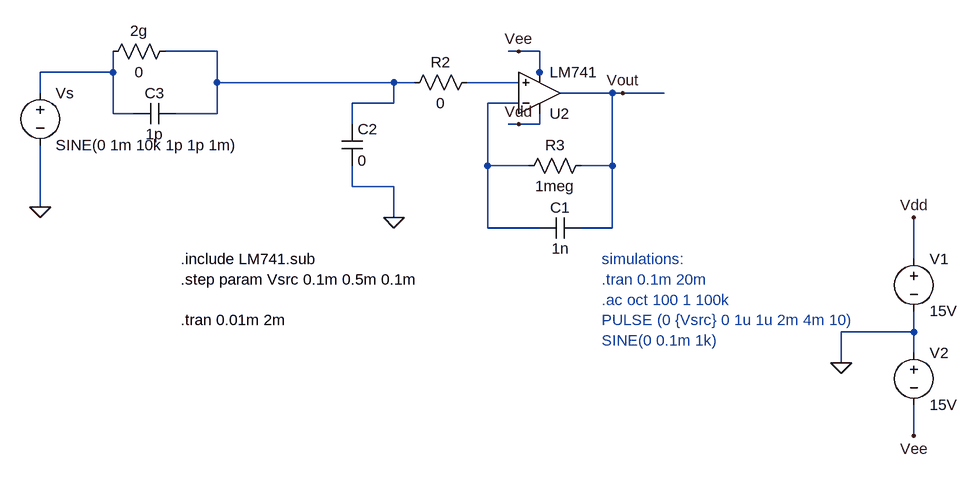
[diagram p0: schematic PiezoSensor.asc]
PiezoSensor.asc, the LTspice schematic file:
Version 4
SHEET 1 1256 680
WIRE 112 -80 32 -80
WIRE 576 -80 560 -80
WIRE 608 -80 576 -80
WIRE -48 -48 -48 -80
WIRE -48 -48 -160 -48
WIRE 608 -48 608 -80
WIRE 112 -32 112 -80
WIRE 384 -32 112 -32
WIRE 416 -32 384 -32
WIRE 576 -32 496 -32
WIRE 608 -32 608 -48
WIRE -160 -16 -160 -48
WIRE 720 -16 640 -16
WIRE 736 -16 720 -16
WIRE 800 -16 736 -16
WIRE 384 0 384 -32
WIRE 384 0 320 0
WIRE 576 0 528 0
WIRE -48 16 -48 -48
WIRE -16 16 -48 16
WIRE 112 16 112 -32
WIRE 112 16 48 16
WIRE 320 32 320 0
WIRE 576 32 560 32
WIRE 608 32 608 16
WIRE 608 32 576 32
WIRE 528 96 528 0
WIRE 592 96 528 96
WIRE 720 96 720 -16
WIRE 720 96 672 96
WIRE 320 128 320 96
WIRE 384 128 320 128
WIRE -160 160 -160 64
WIRE 384 176 384 128
WIRE 528 192 528 96
WIRE 608 192 528 192
WIRE 720 192 720 96
WIRE 720 192 672 192
WIRE 1184 240 1184 176
WIRE 1184 352 1184 320
WIRE 1184 352 1072 352
WIRE 1184 384 1184 352
WIRE 1072 400 1072 352
WIRE 1184 512 1184 464
FLAG 1072 400 0
FLAG 1184 176 Vdd
FLAG 1184 512 Vee
FLAG -160 160 0
FLAG 384 176 0
FLAG 576 -80 Vee
FLAG 736 -16 Vout
FLAG 576 32 Vdd
SYMBOL voltage 1184 224 R0
SYMATTR InstName V1
SYMATTR Value 15V
SYMBOL voltage 1184 368 R0
SYMATTR InstName V2
SYMATTR Value 15V
SYMBOL voltage -160 -32 R0
SYMATTR InstName Vs
SYMATTR Value SINE(0 1m 10k 1p 1p 1m)
SYMATTR Value2 AC 1m
SYMBOL res 48 -96 R90
WINDOW 0 0 56 VBottom 2
WINDOW 3 32 56 VTop 2
SYMATTR InstName 2g
SYMATTR Value 0
SYMBOL cap 304 32 R0
SYMATTR InstName C2
SYMATTR Value 0
SYMBOL res 512 -48 R90
WINDOW 0 0 56 VBottom 2
WINDOW 3 32 56 VTop 2
SYMATTR InstName R2
SYMATTR Value 0
SYMBOL res 688 80 R90
WINDOW 0 0 56 VBottom 2
WINDOW 3 32 56 VTop 2
SYMATTR InstName R3
SYMATTR Value 1meg
SYMBOL cap 672 176 R90
WINDOW 0 0 32 VBottom 2
WINDOW 3 32 32 VTop 2
SYMATTR InstName C1
SYMATTR Value 1n
SYMBOL Opamps/opamp2 608 48 M180
SYMATTR InstName U2
SYMATTR Value LM741
SYMBOL cap 48 0 R90
WINDOW 0 0 32 VBottom 2
WINDOW 3 32 32 VTop 2
SYMATTR InstName C3
SYMATTR Value 1p
TEXT 56 240 Left 2 !.include LM741.sub\n.step param Vsrc 0.1m 0.5m 0.1m\n\n.tran 0.01m 2m
TEXT 704 240 Left 2 ;simulations:\n.tran 0.1m 20m\n.ac oct 100 1 100k\nPULSE (0 {Vsrc} 0 1u 1u 2m 4m 10)\nSINE(0 0.1m 1k)

The netlist it stands for:
* PiezoSensor.asc
V1 Vdd 0 15V
V2 0 Vee 15V
Vs N002 0 SINE(0 1m 10k 1p 1p 1m) AC 1m
R§2g N001 N002 0
C2 N001 0 0
R2 N003 N001 0
R3 Vout N004 1meg
C1 Vout N004 1n
XU2 N003 N004 Vdd Vee Vout LM741  ; pins In+ In- V+ V- OUT
C3 N001 N002 1p
.include LM741.sub
.step param Vsrc 0.1m 0.5m 0.1m
.tran 0.01m 2m
* simulations:
* .tran 0.1m 20m
* .ac oct 100 1 100k
* PULSE (0 {Vsrc} 0 1u 1u 2m 4m 10)
* SINE(0 0.1m 1k)
.backanno
.end